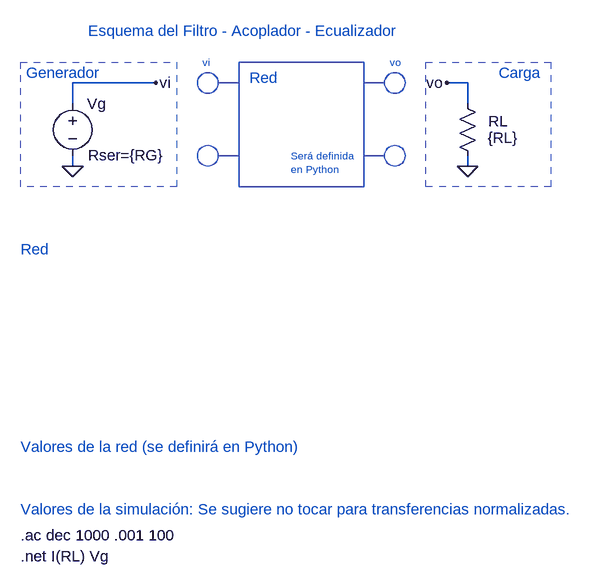
[diagram p0: schematic pyltspice_ecualizador_cheby_orden_2_ripple_3dB_r01_1_r02_2.asc]
pyltspice_ecualizador_cheby_orden_2_ripple_3dB_r01_1_r02_2.asc, the LTspice schematic file:
Version 4
SHEET 1 916 680
WIRE 160 -304 32 -304
WIRE 640 -304 608 -304
WIRE 32 -272 32 -304
WIRE 640 -272 640 -304
WIRE 32 -176 32 -192
WIRE 640 -176 640 -192
FLAG 32 -176 0
FLAG 640 -176 0
FLAG 160 -304 vi
FLAG 608 -304 vo
SYMBOL voltage 32 -288 R0
WINDOW 3 34 121 Invisible 2
WINDOW 39 24 95 Left 2
WINDOW 0 22 16 Left 2
SYMATTR Value 0
SYMATTR SpiceLine Rser={RG}
SYMATTR InstName Vg
SYMATTR Value2 AC 1 0
SYMBOL res 624 -288 R0
WINDOW 0 48 43 Left 2
WINDOW 3 47 68 Left 2
SYMATTR InstName RL
SYMATTR Value {RL}
TEXT -48 424 Left 2 !.net I(RL) Vg
TEXT -48 392 Left 2 !.ac dec 1000 .001 100
TEXT 304 -312 Left 2 ;Red
TEXT -40 -320 Left 2 ;Generador
TEXT 688 -320 Left 2 ;Carga
TEXT 368 -192 Left 1 ;Será definida \nen Python
TEXT -48 256 Left 2 ;Valores de la red (se definirá en Python)
TEXT 56 -384 Left 2 ;Esquema del Filtro - Acoplador - Ecualizador
TEXT -48 352 Left 2 ;Valores de la simulación: Se sugiere no tocar para transferencias normalizadas.
TEXT -48 -48 Left 2 ;Red
TEXT 232 -336 Left 1 ;vi
TEXT 520 -336 Left 1 ;vo
LINE Normal 288 -304 256 -304
LINE Normal 288 -192 256 -192
LINE Normal 480 -192 512 -192
LINE Normal 480 -304 512 -304
RECTANGLE Normal 480 -144 288 -336
RECTANGLE Normal 768 -144 576 -336 2
RECTANGLE Normal 192 -144 -48 -336 2
CIRCLE Normal 256 -288 224 -320
CIRCLE Normal 256 -176 224 -208
CIRCLE Normal 512 -208 544 -176
CIRCLE Normal 512 -320 544 -288

The netlist it stands for:
* pyltspice_ecualizador_cheby_orden_2_ripple_3dB_r01_1_r02_2.asc
Vg vi 0 0 AC 1 0 Rser={RG}
RL vo 0 {RL}
.net I(RL) Vg
.ac dec 1000 .001 100
* Red
* Generador
* Carga
* Será definida
* en Python
* Valores de la red (se definirá en Python)
* Esquema del Filtro - Acoplador - Ecualizador
* Valores de la simulación: Se sugiere no tocar para transferencias normalizadas.
* Red
* vi
* vo
.backanno
.end